# Altium schematic sheet schematic.SchDoc: STM32-Bluetooth-Quat
size A4; Author: Tran Dat Tuyen; DrawnBy: Tran Dat Tuyen; DocumentNumber: 1; Revision: 1.0; SheetNumber: 1; SheetTotal: 1; Namedesign: Tran Dat Tuyen; Project: Quat Thong minh dieu khien qua bluetooth; PageSetup: Record=PageOptions|CenterHorizontal=True|CenterVertical=True|PrintScale=0.94|XCorrection=1.00|YCorrection=1.00|PrintKind=0|BorderSize=5000000|LeftOffset=0|BottomOffset=0|Orientation=2|PaperLength=1000|PaperWidth=1000|Scale=100|PaperSource=7|PrintQuality=-3|MediaType=1|DitherType=10|PrintScaleMode=1|PaperKind=Letter|PaperIndex=1
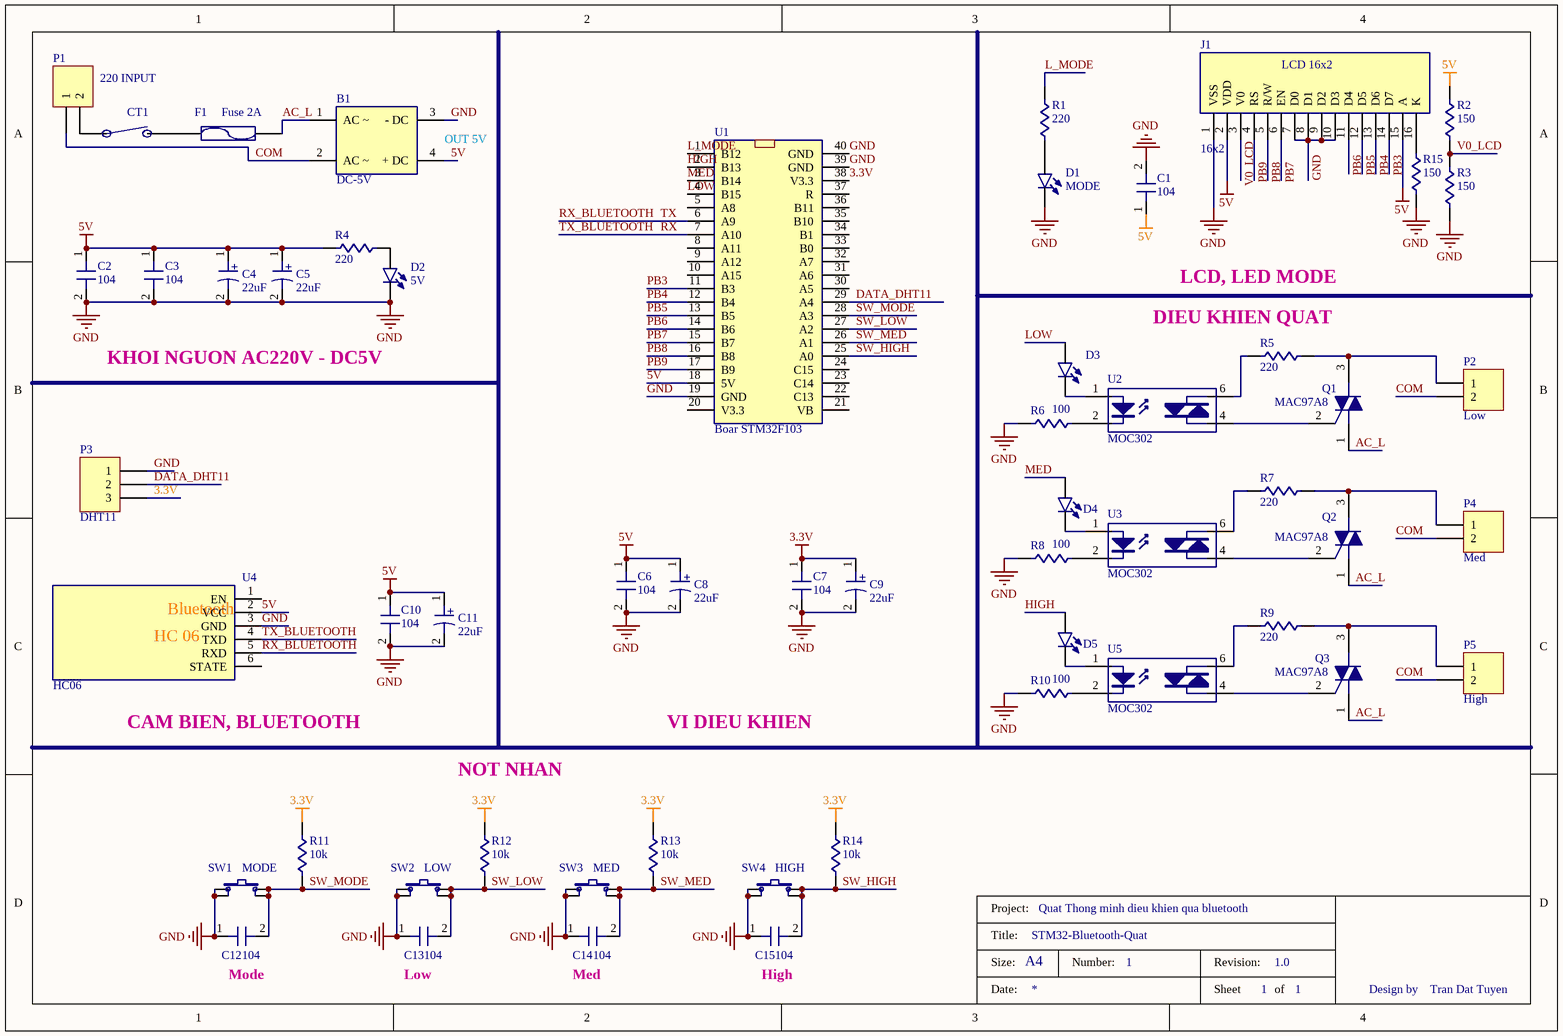
[diagram p0: schematic.SchDoc]

## Parts
B1  DC-5V  [AC-DC_LK-PM01]
C1  104  [RES0805]
C2  104  [RES0805]
C3  104  [RES0805]
C4  22uF  [CAP_T_3528–21_CASE-B]
C5  22uF  [CAP_T_3528–21_CASE-B]
C6  104  [RES0805]
C7  104  [RES0805]
C8  22uF  [CAP_T_3528–21_CASE-B]
C9  22uF  [CAP_T_3528–21_CASE-B]
C10  104  [RES0805]
C11  22uF  [CAP_T_3528–21_CASE-B]
C12  104  [RES0805]
C13  104  [RES0805]
C14  104  [RES0805]
C15  104  [RES0805]
CT1  CONTAC  [HDR1X2200Mil]  (value not drawn)
D1  MODE  [LED3]
D2  5V  [LED3]
D3  LOW  [LED3]  (value not drawn)
D4  MED  [LED3]  (value not drawn)
D5  SWING  [LED3]  (value not drawn)
F1  Fuse 2A  [FUSE_PIN-W2/E2.8]
J1  16x2  [LCD16x2_16PIN]
P1  220 INPUT  [TERMINAL_2PIN_1]
P2  Low  [TERMINAL_2PIN_1]
P3  DHT11  [HDR1X3]
P4  Med  [TERMINAL_2PIN_1]
P5  High  [TERMINAL_2PIN_1]
Q1  MAC97A8  [TO92D]
Q2  MAC97A8  [TO92D]
Q3  MAC97A8  [TO92D]
R1  220  [RES0805]
R2  150  [RES0805]
R3  150  [RES0805]
R4  220  [RES0805]
R5  220  [RES0805]
R6  100  [RES0805]
R7  220  [RES0805]
R8  100  [RES0805]
R9  220  [RES0805]
R10  100  [RES0805]
R11  10k  [RES0805]
R12  10k  [RES0805]
R13  10k  [RES0805]
R14  10k  [RES0805]
R15  150  [RES0805]
SW1  MODE  [SW_4PIN_6x6x5]
SW2  LOW  [SW_4PIN_6x6x5]
SW3  MED  [SW_4PIN_6x6x5]
SW4  HIGH  [SW_4PIN_6x6x5]
U1  Boar STM32F103  [KIT_STM32F103C8T6_40PIN_2]
U2  MOC302  [DIP6]
U3  MOC302  [DIP6]
U4  HC06  [BLUETOOTH_HC05_MD]
U5  MOC302  [DIP6]

## Nets
3.3V: C7.1 C9.1 P3.3 R11.2 R12.2 R13.2 R14.2 U1.38(V3.3)
5V: B1.4(+_DC) C1.1 C2.1 C3.1 C4.1 C5.1 C6.1 C8.1 C10.1 C11.1 J1.2(VDD) J1.15(A) R2.2 R4.2 U1.18(5V) U4.2(VCC)
GND: B1.3(-_DC) C1.2 C2.2 C3.2 C4.2 C5.2 C6.2 C7.2 C8.2 C9.2 C10.2 C11.2 C12.1 C13.1 C14.1 C15.1 D1.2 D2.2 J1.1(VSS) J1.7(D0) J1.8(D1) J1.9(D2) J1.10(D3) P3.1 R3.1 R6.2 R8.1 R10.2 R15.1 SW1.1 SW1.2 SW2.1 SW2.2 SW3.1 SW3.2 SW4.1 SW4.2 U1.19(GND) U1.39(GND) U1.40(GND) U4.3(GND)
AC_L: B1.1(AC_~) F1.1 Q1.1(M1) Q2.1(M1) Q3.1(M1)
COM: B1.2(AC_~) P1.1 P2.2 P4.2 P5.2
DATA_DHT11: P3.2 U1.29(A4)
HIGH: D5.1 U1.2(B13)
L_MODE: R1.2 U1.1(B12)
LOW: D3.1 U1.4(B15)
MED: D4.1 U1.3(B14)
PB3: J1.14(D7) U1.11(B3)
PB4: J1.13(D6) U1.12(B4)
PB5: J1.12(D5) U1.13(B5)
PB6: J1.11(D4) U1.14(B6)
PB7: J1.6(EN) U1.15(B7)
PB8: J1.5(R/W) U1.16(B8)
PB9: J1.4(RS) U1.17(B9)
RX: U1.7(A10) U4.4(TXD)  [also labelled TX_BLUETOOTH]
RX_BLUETOOTH: U1.6(A9) U4.5(RXD)  [also labelled TX]
SW_HIGH: C15.2 R14.1 SW4.3 SW4.4 U1.25(A0)
SW_LOW: C13.2 R12.1 SW2.3 SW2.4 U1.27(A2)
SW_MED: C14.2 R13.1 SW3.3 SW3.4 U1.26(A1)
SW_MODE: C12.2 R11.1 SW1.3 SW1.4 U1.28(A3)
V0_LCD: J1.3(V0) R2.1 R3.2
NetCT1_1: CT1.1 P1.2
NetCT1_2: CT1.2 F1.2
NetD1_1: D1.1 R1.1
NetD2_1: D2.1 R4.1
NetD3_2: D3.2 U2.1(A)
NetD4_2: D4.2 U3.1(A)
NetD5_2: D5.2 U5.1(A)
NetJ1_16: J1.16(K) R15.2
NetP2_1: P2.1 Q1.3(M2) R5.1
NetP4_1: P4.1 Q2.3(M2) R7.1
NetP5_1: P5.1 Q3.3(M2) R9.1
NetQ1_2: Q1.2(G) U2.4
NetQ2_2: Q2.2(G) U3.4
NetQ3_2: Q3.2(G) U5.4
NetR5_2: R5.2 U2.6
NetR6_1: R6.1 U2.2(K)
NetR7_2: R7.2 U3.6
NetR8_2: R8.2 U3.2(K)
NetR9_2: R9.2 U5.6
NetR10_1: R10.1 U5.2(K)

Not connected (* = marked no-connect by the designer): U1 5(A8) 8(A11) 9(A12) 10(A15) 20(V3.3) 21(VB) 22(C13) 23(C14) 24(C15) 30(A5) 31(A6) 32(A7) 33(B0) 34(B1) 35(B10) 36(B11) 37(R); U2 3(NC) 5(NC); U3 3(NC) 5(NC); U4 1(EN) 6(STATE); U5 3(NC) 5(NC)

## Notes on the sheet
- (near B1) OUT 5V
- LCD, LED MODE
- KHOI NGUON AC220V - DC5V
- (near R5) DIEU KHIEN QUAT
- (near U4) CAM BIEN, BLUETOOTH
- NOT NHAN
- VI DIEU KHIEN
- (near C12) Mode
- (near C13) Low
- (near C14) Med
- (near C15) High
- Project:
- Title:
- Size:
- A4
- Number:
- Revision:
- Date:
- Sheet
- of
- Design by
- (in symbol Bluetooth_HC06_MD) Bluetooth; HC 06
- (in symbol CAP_E) +
- (in symbol LCD16X2) LCD 16x2

## Library data of the parts
B1 = AC-DC: power 5v dc; Value: DC-5V
C1-C3 C6 C7 C10 = CAP: VALUE: 104
C4 C5 C8 C9 C11 = CAP_E
C12-C15 = CAP: VALUE: 100uF
D1-D5 = LED: VALUE: LED-5V
F1 = FUSE: Fuse 1A 3.6mmx10mm
J1 = LCD16X2: 16 PIN
P1 P2 P4 P5 = Header 2: Header, 2-Pin; LatestRevisionDate: 17-Jul-2002; LatestRevisionNote: Re-released for DXP Platform.; Publisher: Altium Limited
P3 = Header 3: Header, 3-Pin; LatestRevisionDate: 17-Jul-2002; LatestRevisionNote: Re-released for DXP Platform.; Publisher: Altium Limited
Q1-Q3 = MAC97A8: Triac 600V 0.6A; value: MAC97A8
R1-R15 = RES
SW1-SW4 = SW_4PIN
U1 = STM32f103C8T6_KIT2
U2 U3 U5 = MOC3020: Opto 400V
U4 = Bluetooth_HC06_MD: bluetooth HC06